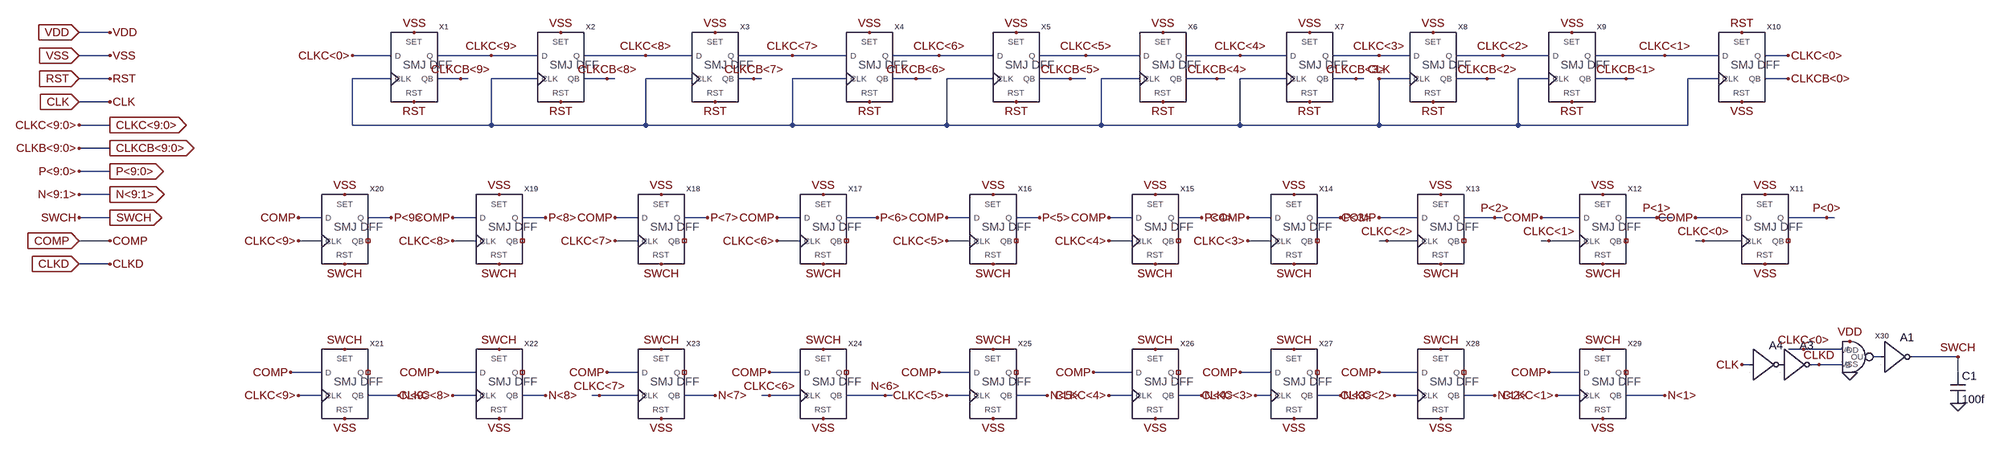
[diagram p0: schematic 10Bit_SAR_Logic.asc]
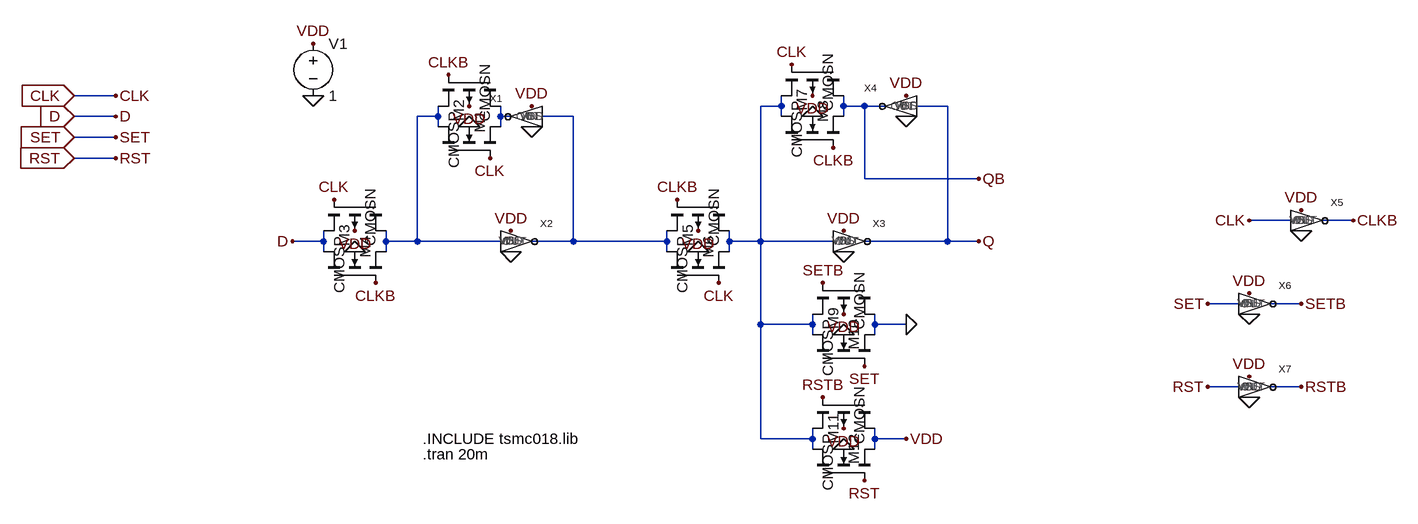
[diagram p1: sub-circuit smj_dff_x1.asc]
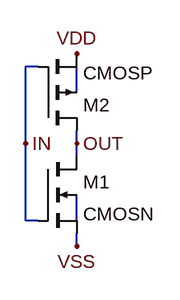
[diagram p2: sub-circuit inv_x1.asc]
10Bit_SAR_Logic.asc, the LTspice schematic file:
Version 4
SHEET 1 3224 984
WIRE -1040 -384 -1104 -384
WIRE -1040 -336 -1104 -336
WIRE -384 -336 -464 -336
WIRE -176 -336 -288 -336
WIRE -80 -336 -176 -336
WIRE 144 -336 16 -336
WIRE 240 -336 144 -336
WIRE 448 -336 336 -336
WIRE 560 -336 448 -336
WIRE 752 -336 656 -336
WIRE 864 -336 752 -336
WIRE 1056 -336 960 -336
WIRE 1168 -336 1056 -336
WIRE 1376 -336 1264 -336
WIRE 1472 -336 1376 -336
WIRE 1664 -336 1568 -336
WIRE 1728 -336 1664 -336
WIRE 1920 -336 1824 -336
WIRE 2016 -336 1920 -336
WIRE 2256 -336 2112 -336
WIRE 2368 -336 2256 -336
WIRE 2512 -336 2464 -336
WIRE -1040 -288 -1104 -288
WIRE -384 -288 -464 -288
WIRE -240 -288 -288 -288
WIRE -224 -288 -240 -288
WIRE -80 -288 -176 -288
WIRE 64 -288 16 -288
WIRE 80 -288 64 -288
WIRE 240 -288 144 -288
WIRE 368 -288 336 -288
WIRE 384 -288 368 -288
WIRE 560 -288 448 -288
WIRE 704 -288 656 -288
WIRE 736 -288 704 -288
WIRE 864 -288 768 -288
WIRE 1024 -288 960 -288
WIRE 1056 -288 1024 -288
WIRE 1168 -288 1088 -288
WIRE 1328 -288 1264 -288
WIRE 1344 -288 1328 -288
WIRE 1472 -288 1376 -288
WIRE 1616 -288 1568 -288
WIRE 1632 -288 1616 -288
WIRE 1728 -288 1664 -288
WIRE 1888 -288 1824 -288
WIRE 1904 -288 1888 -288
WIRE 2016 -288 1952 -288
WIRE 2176 -288 2112 -288
WIRE 2192 -288 2176 -288
WIRE 2368 -288 2304 -288
WIRE 2512 -288 2464 -288
WIRE -1040 -240 -1104 -240
WIRE -1040 -192 -1104 -192
WIRE -464 -192 -464 -288
WIRE -176 -192 -176 -288
WIRE -176 -192 -464 -192
WIRE 144 -192 144 -288
WIRE 144 -192 -176 -192
WIRE 448 -192 448 -288
WIRE 448 -192 144 -192
WIRE 768 -192 768 -288
WIRE 768 -192 448 -192
WIRE 1088 -192 1088 -288
WIRE 1088 -192 768 -192
WIRE 1376 -192 1376 -288
WIRE 1376 -192 1088 -192
WIRE 1664 -192 1664 -288
WIRE 1664 -192 1376 -192
WIRE 1952 -192 1952 -288
WIRE 1952 -192 1664 -192
WIRE 2304 -192 2304 -288
WIRE 2304 -192 1952 -192
WIRE -1040 -144 -1104 -144
WIRE -1040 -96 -1104 -96
WIRE -1040 -48 -1104 -48
WIRE -1040 0 -1104 0
WIRE -528 0 -576 0
WIRE -384 0 -432 0
WIRE -208 0 -256 0
WIRE -64 0 -112 0
WIRE 128 0 80 0
WIRE 272 0 224 0
WIRE 464 0 416 0
WIRE 624 0 560 0
WIRE 816 0 768 0
WIRE 960 0 912 0
WIRE 1152 0 1104 0
WIRE 1296 0 1248 0
WIRE 1440 0 1392 0
WIRE 1584 0 1536 0
WIRE 1744 0 1664 0
WIRE 1904 0 1840 0
WIRE 1920 0 1904 0
WIRE 2080 0 2000 0
WIRE 2240 0 2176 0
WIRE 2272 0 2240 0
WIRE 2416 0 2320 0
WIRE 2592 0 2512 0
WIRE 2608 0 2592 0
WIRE -1040 48 -1104 48
WIRE -528 48 -576 48
WIRE -208 48 -256 48
WIRE 128 48 80 48
WIRE 464 48 416 48
WIRE 816 48 768 48
WIRE 1152 48 1104 48
WIRE 1440 48 1392 48
WIRE 1680 48 1664 48
WIRE 1744 48 1680 48
WIRE 2016 48 2000 48
WIRE 2080 48 2016 48
WIRE 2336 48 2320 48
WIRE 2416 48 2336 48
WIRE -1040 96 -1104 96
WIRE 2544 336 2512 336
WIRE 2624 336 2544 336
WIRE 2704 352 2688 352
WIRE 2864 352 2768 352
WIRE 2432 368 2416 368
WIRE 2576 368 2560 368
WIRE 2624 368 2576 368
WIRE -528 384 -592 384
WIRE -208 384 -288 384
WIRE 128 384 64 384
WIRE 464 384 400 384
WIRE 816 384 752 384
WIRE 1152 384 1072 384
WIRE 1440 384 1376 384
WIRE 1744 384 1664 384
WIRE 2080 384 2016 384
WIRE 2864 384 2864 352
WIRE -528 432 -576 432
WIRE -368 432 -432 432
WIRE -208 432 -256 432
WIRE -64 432 -112 432
WIRE 48 432 32 432
WIRE 128 432 48 432
WIRE 288 432 224 432
WIRE 400 432 384 432
WIRE 464 432 400 432
WIRE 640 432 560 432
WIRE 656 432 640 432
WIRE 816 432 768 432
WIRE 976 432 912 432
WIRE 1152 432 1104 432
WIRE 1296 432 1248 432
WIRE 1440 432 1408 432
WIRE 1584 432 1536 432
WIRE 1744 432 1696 432
WIRE 1904 432 1840 432
WIRE 2080 432 2032 432
WIRE 2256 432 2176 432
FLAG 1664 -336 CLKC<3>
FLAG 1920 -336 CLKC<2>
FLAG 2256 -336 CLKC<1>
FLAG 1664 -288 CLK
FLAG 1792 -48 VSS
FLAG 2464 -48 VSS
FLAG 2128 -48 VSS
FLAG 2464 96 VSS
FLAG 176 336 SWCH
FLAG 512 336 SWCH
FLAG 1904 0 P<2>
FLAG 2240 0 P<1>
FLAG 2592 0 P<0>
FLAG 1680 48 CLKC<2>
FLAG 2016 48 CLKC<1>
FLAG 2336 48 CLKC<0>
FLAG 48 432 CLKC<7>
FLAG 400 432 CLKC<6>
FLAG 288 432 N<7>
FLAG 640 432 N<6>
FLAG 2544 336 CLKC<0>
FLAG 2416 -240 VSS
FLAG 1776 -240 RST
FLAG 2064 -240 RST
FLAG 1776 -384 VSS
FLAG 2064 -384 VSS
FLAG 2416 -384 RST
FLAG 2000 0 COMP
FLAG 2320 0 COMP
FLAG 400 384 COMP
FLAG 64 384 COMP
FLAG 1664 0 COMP
FLAG 2512 -336 CLKC<0>
FLAG 2864 448 0
FLAG 1792 96 SWCH
FLAG 2128 96 SWCH
FLAG 176 480 VSS
FLAG 512 480 VSS
FLAG 2864 352 SWCH
FLAG 1520 -384 VSS
FLAG 1520 -240 RST
FLAG 1216 -384 VSS
FLAG 1216 -240 RST
FLAG 1376 -336 CLKC<4>
FLAG 912 -384 VSS
FLAG 912 -240 RST
FLAG 608 -240 RST
FLAG 608 -384 VSS
FLAG 288 -240 RST
FLAG 288 -384 VSS
FLAG -32 -384 VSS
FLAG -32 -240 RST
FLAG 752 -336 CLKC<6>
FLAG 448 -336 CLKC<7>
FLAG 144 -336 CLKC<8>
FLAG -336 -384 VSS
FLAG -336 -240 RST
FLAG -464 -336 CLKC<0>
FLAG -176 -336 CLKC<9>
FLAG 1584 0 P<3>
FLAG 1392 0 COMP
FLAG 1392 48 CLKC<3>
FLAG 1296 0 P<4>
FLAG 1104 0 COMP
FLAG 1104 48 CLKC<4>
FLAG 768 0 COMP
FLAG 768 48 CLKC<5>
FLAG 960 0 P<5>
FLAG 272 0 P<7>
FLAG 80 0 COMP
FLAG 80 48 CLKC<7>
FLAG -64 0 P<8>
FLAG -256 0 COMP
FLAG -256 48 CLKC<8>
FLAG -576 0 COMP
FLAG -576 48 CLKC<9>
FLAG 416 0 COMP
FLAG 416 48 CLKC<6>
FLAG 624 0 P<6>
FLAG 1488 -48 VSS
FLAG 1488 96 SWCH
FLAG 1200 -48 VSS
FLAG 1200 96 SWCH
FLAG 864 -48 VSS
FLAG 864 96 SWCH
FLAG 512 -48 VSS
FLAG 512 96 SWCH
FLAG 176 -48 VSS
FLAG 176 96 SWCH
FLAG -160 -48 VSS
FLAG -160 96 SWCH
FLAG -480 -48 VSS
FLAG -480 96 SWCH
FLAG -592 384 COMP
FLAG -576 432 CLKC<9>
FLAG -288 384 COMP
FLAG -368 432 N<9>
FLAG -256 432 CLKC<8>
FLAG -64 432 N<8>
FLAG 752 384 COMP
FLAG 768 432 CLKC<5>
FLAG 976 432 N<5>
FLAG 1072 384 COMP
FLAG 1104 432 CLKC<4>
FLAG 1296 432 N<4>
FLAG 1376 384 COMP
FLAG 1408 432 CLKC<3>
FLAG 1584 432 N<3>
FLAG 1664 384 COMP
FLAG 1696 432 CLKC<2>
FLAG 1904 432 N<2>
FLAG 2016 384 COMP
FLAG 2032 432 CLKC<1>
FLAG 2256 432 N<1>
FLAG -480 336 SWCH
FLAG -160 336 SWCH
FLAG -480 480 VSS
FLAG -160 480 VSS
FLAG 1200 336 SWCH
FLAG 864 480 VSS
FLAG 864 336 SWCH
FLAG 1200 480 VSS
FLAG 1488 336 SWCH
FLAG 1488 480 VSS
FLAG 1792 336 SWCH
FLAG 1792 480 VSS
FLAG 2128 336 SWCH
FLAG 2128 480 VSS
FLAG -1104 -336 VSS
IOPIN -1104 -336 In
FLAG -1104 -288 RST
IOPIN -1104 -288 In
FLAG -1104 -240 CLK
IOPIN -1104 -240 In
FLAG -1104 -192 CLKC<9:0>
FLAG -1104 -96 P<9:0>
FLAG -1104 -48 N<9:1>
FLAG -1104 0 SWCH
FLAG -1104 48 COMP
IOPIN -1104 48 In
FLAG -1104 -384 VDD
IOPIN -1104 -384 In
FLAG -1040 -384 VDD
FLAG -1040 -336 VSS
FLAG -1040 -288 RST
FLAG -1040 -240 CLK
FLAG -1040 -192 CLKC<9:0>
IOPIN -1040 -192 Out
FLAG -1040 -96 P<9:0>
IOPIN -1040 -96 Out
FLAG -1040 -48 N<9:1>
IOPIN -1040 -48 Out
FLAG -1040 0 SWCH
IOPIN -1040 0 Out
FLAG -1040 48 COMP
FLAG 1056 -336 CLKC<5>
FLAG -384 0 P<9>
FLAG 2640 384 0
FLAG 2640 320 VDD
FLAG 2416 368 CLK
FLAG 2512 -288 CLKCB<0>
FLAG 2176 -288 CLKCB<1>
FLAG 1888 -288 CLKCB<2>
FLAG 1616 -288 CLKCB<3>
FLAG 1328 -288 CLKCB<4>
FLAG 1024 -288 CLKCB<5>
FLAG 704 -288 CLKCB<6>
FLAG 64 -288 CLKCB<8>
FLAG -240 -288 CLKCB<9>
FLAG 368 -288 CLKCB<7>
FLAG 2576 368 CLKD
FLAG -1104 96 CLKD
IOPIN -1104 96 In
FLAG -1040 96 CLKD
FLAG -1040 -144 CLKCB<9:0>
IOPIN -1040 -144 Out
FLAG -1104 -144 CLKB<9:0>
SYMBOL cap 2848 384 R0
SYMATTR InstName C1
SYMATTR Value 100f
SYMBOL NAND_x1 2640 352 R0
SYMATTR InstName X30
SYMBOL Digital\\inv 2704 288 R0
SYMATTR InstName A1
SYMBOL Digital\\inv 2496 304 R0
SYMATTR InstName A3
SYMATTR SpiceLine Trise 0.0025u Tfall 0.0025u
SYMBOL Digital\\inv 2432 304 R0
SYMATTR InstName A4
SYMATTR SpiceLine Trise 0.0025u Tfall 0.0025u
SYMBOL smj_dff_x1 -336 -320 R0
SYMATTR InstName X1
SYMBOL smj_dff_x1 -32 -320 R0
SYMATTR InstName X2
SYMBOL smj_dff_x1 288 -320 R0
SYMATTR InstName X3
SYMBOL smj_dff_x1 608 -320 R0
SYMATTR InstName X4
SYMBOL smj_dff_x1 912 -320 R0
SYMATTR InstName X5
SYMBOL smj_dff_x1 1216 -320 R0
SYMATTR InstName X6
SYMBOL smj_dff_x1 1520 -320 R0
SYMATTR InstName X7
SYMBOL smj_dff_x1 1776 -320 R0
SYMATTR InstName X8
SYMBOL smj_dff_x1 2064 -320 R0
SYMATTR InstName X9
SYMBOL smj_dff_x1 2416 -320 R0
SYMATTR InstName X10
SYMBOL smj_dff_x1 2464 16 R0
SYMATTR InstName X11
SYMBOL smj_dff_x1 2128 16 R0
SYMATTR InstName X12
SYMBOL smj_dff_x1 1792 16 R0
SYMATTR InstName X13
SYMBOL smj_dff_x1 1488 16 R0
SYMATTR InstName X14
SYMBOL smj_dff_x1 1200 16 R0
SYMATTR InstName X15
SYMBOL smj_dff_x1 864 16 R0
SYMATTR InstName X16
SYMBOL smj_dff_x1 512 16 R0
SYMATTR InstName X17
SYMBOL smj_dff_x1 176 16 R0
SYMATTR InstName X18
SYMBOL smj_dff_x1 -160 16 R0
SYMATTR InstName X19
SYMBOL smj_dff_x1 -480 16 R0
SYMATTR InstName X20
SYMBOL smj_dff_x1 -480 400 R0
SYMATTR InstName X21
SYMBOL smj_dff_x1 -160 400 R0
SYMATTR InstName X22
SYMBOL smj_dff_x1 176 400 R0
SYMATTR InstName X23
SYMBOL smj_dff_x1 512 400 R0
SYMATTR InstName X24
SYMBOL smj_dff_x1 864 400 R0
SYMATTR InstName X25
SYMBOL smj_dff_x1 1200 400 R0
SYMATTR InstName X26
SYMBOL smj_dff_x1 1488 400 R0
SYMATTR InstName X27
SYMBOL smj_dff_x1 1792 400 R0
SYMATTR InstName X28
SYMBOL smj_dff_x1 2128 400 R0
SYMATTR InstName X29

smj_dff_x1.asc, the sub-circuit schematic file:
Version 4
SHEET 1 1408 932
WIRE -528 96 -592 96
WIRE 496 112 496 96
WIRE 496 112 464 112
WIRE 592 112 592 96
WIRE 624 112 592 112
WIRE 656 112 624 112
WIRE 752 112 704 112
WIRE -528 128 -592 128
WIRE -32 128 -32 112
WIRE -32 128 -64 128
WIRE 64 128 64 112
WIRE 80 128 64 128
WIRE 176 128 128 128
WIRE 496 128 496 112
WIRE 592 128 592 112
WIRE -32 144 -32 128
WIRE 64 144 64 128
WIRE -528 160 -592 160
WIRE -528 192 -592 192
WIRE 624 224 624 112
WIRE 800 224 624 224
WIRE 1280 288 1216 288
WIRE 1376 288 1328 288
WIRE -208 320 -208 304
WIRE -208 320 -256 320
WIRE -112 320 -112 304
WIRE -64 320 -64 128
WIRE -64 320 -112 320
WIRE 64 320 -64 320
WIRE 176 320 176 128
WIRE 176 320 112 320
WIRE 320 320 320 304
WIRE 320 320 176 320
WIRE 416 320 416 304
WIRE 464 320 464 112
WIRE 464 320 416 320
WIRE 576 320 464 320
WIRE 752 320 752 112
WIRE 752 320 624 320
WIRE 800 320 752 320
WIRE -208 336 -208 320
WIRE -112 336 -112 320
WIRE 320 336 320 320
WIRE 416 336 416 320
WIRE 1200 416 1152 416
WIRE 1296 416 1248 416
WIRE 464 448 464 320
WIRE 544 448 544 432
WIRE 544 448 464 448
WIRE 640 448 640 432
WIRE 688 448 640 448
WIRE 544 464 544 448
WIRE 640 464 640 448
WIRE 1200 544 1152 544
WIRE 1296 544 1248 544
WIRE 464 624 464 448
WIRE 544 624 544 608
WIRE 544 624 464 624
WIRE 640 624 640 608
WIRE 688 624 640 624
WIRE 544 640 544 624
WIRE 640 640 640 624
FLAG -192 256 CLK
FLAG 48 192 CLK
FLAG 576 176 CLKB
FLAG 400 384 CLK
FLAG -16 64 CLKB
FLAG -128 384 CLKB
FLAG 336 256 CLKB
FLAG 512 48 CLK
FLAG -256 320 D
FLAG 800 320 Q
FLAG 800 224 QB
FLAG 1376 288 CLKB
FLAG 1216 288 CLK
FLAG 1296 272 VDD
FLAG 1296 304 0
FLAG -224 96 0
FLAG -224 16 VDD
FLAG 16 144 0
FLAG -160 336 0
FLAG 368 336 0
FLAG 544 128 0
FLAG 16 112 VDD
FLAG -160 304 VDD
FLAG 368 304 VDD
FLAG 544 96 VDD
FLAG 624 512 SET
FLAG 560 384 SETB
FLAG 592 464 0
FLAG 592 432 VDD
FLAG 624 688 RST
FLAG 560 560 RSTB
FLAG 592 640 0
FLAG 592 608 VDD
FLAG 688 448 0
FLAG 688 624 VDD
FLAG 1216 400 VDD
FLAG 1216 432 0
FLAG 1152 416 SET
FLAG 1296 416 SETB
FLAG 1216 528 VDD
FLAG 1216 560 0
FLAG 1152 544 RST
FLAG 1296 544 RSTB
FLAG 112 112 VDD
FLAG 80 304 VDD
FLAG 592 304 VDD
FLAG 688 96 VDD
FLAG 112 144 0
FLAG 80 336 0
FLAG 592 336 0
FLAG 688 128 0
FLAG -592 96 CLK
IOPIN -592 96 In
FLAG -592 128 D
IOPIN -592 128 In
FLAG -592 160 SET
IOPIN -592 160 In
FLAG -592 192 RST
IOPIN -592 192 In
FLAG -528 96 CLK
FLAG -528 128 D
FLAG -528 160 SET
FLAG -528 192 RST
SYMBOL cmosn -32 192 R270
SYMATTR InstName M2
SYMATTR Value2 l=180n w=1u
SYMBOL cmosp 64 64 R90
SYMATTR InstName M1
SYMATTR Value2 l=180n w=5u
SYMBOL cmosn -208 384 R270
SYMATTR InstName M3
SYMATTR Value2 l=180n w=1u
SYMBOL cmosp -112 256 R90
SYMATTR InstName M4
SYMATTR Value2 l=180n w=5u
SYMBOL cmosn 320 384 R270
SYMATTR InstName M5
SYMATTR Value2 l=180n w=1u
SYMBOL cmosp 416 256 R90
SYMATTR InstName M6
SYMATTR Value2 l=180n w=5u
SYMBOL cmosn 496 176 R270
SYMATTR InstName M7
SYMATTR Value2 l=180n w=1u
SYMBOL cmosp 592 48 R90
SYMATTR InstName M8
SYMATTR Value2 l=180n w=5u
SYMBOL inv_x1 1312 288 R0
SYMATTR InstName X5
SYMBOL voltage -224 0 R0
WINDOW 123 0 0 Left 0
WINDOW 39 0 0 Left 0
SYMATTR InstName V1
SYMATTR Value 1
SYMBOL cmosn 544 512 R270
SYMATTR InstName M9
SYMATTR Value2 l=180n w=1u
SYMBOL cmosp 640 384 R90
SYMATTR InstName M10
SYMATTR Value2 l=180n w=5u
SYMBOL cmosn 544 688 R270
SYMATTR InstName M11
SYMATTR Value2 l=180n w=1u
SYMBOL cmosp 640 560 R90
SYMATTR InstName M12
SYMATTR Value2 l=180n w=5u
SYMBOL inv_x1 1232 416 R0
SYMATTR InstName X6
SYMBOL inv_x1 1232 544 R0
SYMATTR InstName X7
SYMBOL inv_x1 96 128 M0
SYMATTR InstName X1
SYMBOL inv_x1 96 320 R0
SYMATTR InstName X2
SYMBOL inv_x1 608 320 R0
SYMATTR InstName X3
SYMBOL inv_x1 672 112 M0
SYMATTR InstName X4
TEXT -56 648 Left 2 !.tran 20m
TEXT -56 624 Left 2 !.INCLUDE tsmc018.lib

inv_x1.asc, the sub-circuit schematic file:
Version 4
SHEET 1 880 680
WIRE 160 48 144 48
WIRE 208 80 208 48
WIRE 144 144 144 48
WIRE 208 144 208 128
WIRE 208 160 208 144
WIRE 144 240 144 144
WIRE 160 240 144 240
WIRE 208 240 208 208
WIRE 208 272 208 256
FLAG 208 32 VDD
FLAG 208 272 VSS
FLAG 144 144 IN
FLAG 208 144 OUT
SYMBOL cmosn 160 160 R0
SYMATTR InstName M1
SYMATTR Value2 l=180nm w=1um
SYMBOL cmosp 160 128 M180
SYMATTR InstName M2
SYMATTR Value2 l=180nm w=5um

The netlist it stands for:
* 10Bit_SAR_Logic.asc
C1 SWCH 0 100f
XX30 CLKC<0> CLKD VDD 0 N001 NAND_x1  ; pins A B VDD VSS OUT
A1 N001 0 0 0 0 SWCH 0 0 BUF
A3 P001 0 0 0 0 CLKD 0 0 BUF Trise 0.0025u Tfall 0.0025u
A4 CLK 0 0 0 0 P001 0 0 BUF Trise 0.0025u Tfall 0.0025u
XX1 CLKC<0> CLKC<9> CLK VSS RST CLKCB<9> smj_dff_x1
XX2 CLKC<9> CLKC<8> CLK VSS RST CLKCB<8> smj_dff_x1
XX3 CLKC<8> CLKC<7> CLK VSS RST CLKCB<7> smj_dff_x1
XX4 CLKC<7> CLKC<6> CLK VSS RST CLKCB<6> smj_dff_x1
XX5 CLKC<6> CLKC<5> CLK VSS RST CLKCB<5> smj_dff_x1
XX6 CLKC<5> CLKC<4> CLK VSS RST CLKCB<4> smj_dff_x1
XX7 CLKC<4> CLKC<3> CLK VSS RST CLKCB<3> smj_dff_x1
XX8 CLKC<3> CLKC<2> CLK VSS RST CLKCB<2> smj_dff_x1
XX9 CLKC<2> CLKC<1> CLK VSS RST CLKCB<1> smj_dff_x1
XX10 CLKC<1> CLKC<0> CLK RST VSS CLKCB<0> smj_dff_x1
XX11 COMP P<0> CLKC<0> VSS VSS NC_01 smj_dff_x1
XX12 COMP P<1> CLKC<1> VSS SWCH NC_02 smj_dff_x1
XX13 COMP P<2> CLKC<2> VSS SWCH NC_03 smj_dff_x1
XX14 COMP P<3> CLKC<3> VSS SWCH NC_04 smj_dff_x1
XX15 COMP P<4> CLKC<4> VSS SWCH NC_05 smj_dff_x1
XX16 COMP P<5> CLKC<5> VSS SWCH NC_06 smj_dff_x1
XX17 COMP P<6> CLKC<6> VSS SWCH NC_07 smj_dff_x1
XX18 COMP P<7> CLKC<7> VSS SWCH NC_08 smj_dff_x1
XX19 COMP P<8> CLKC<8> VSS SWCH NC_09 smj_dff_x1
XX20 COMP P<9> CLKC<9> VSS SWCH NC_10 smj_dff_x1
XX21 COMP NC_11 CLKC<9> SWCH VSS N<9> smj_dff_x1
XX22 COMP NC_12 CLKC<8> SWCH VSS N<8> smj_dff_x1
XX23 COMP NC_13 CLKC<7> SWCH VSS N<7> smj_dff_x1
XX24 COMP NC_14 CLKC<6> SWCH VSS N<6> smj_dff_x1
XX25 COMP NC_15 CLKC<5> SWCH VSS N<5> smj_dff_x1
XX26 COMP NC_16 CLKC<4> SWCH VSS N<4> smj_dff_x1
XX27 COMP NC_17 CLKC<3> SWCH VSS N<3> smj_dff_x1
XX28 COMP NC_18 CLKC<2> SWCH VSS N<2> smj_dff_x1
XX29 COMP NC_19 CLKC<1> SWCH VSS N<1> smj_dff_x1

* block symbol definitions
.subckt smj_dff_x1 D Q CLK SET RST QB
M2 N002 CLK N003 0 CMOSN l=180n w=1u
M1 N003 CLKB N002 VDD CMOSP l=180n w=5u
M3 D CLKB N002 0 CMOSN l=180n w=1u
M4 N002 CLK D VDD CMOSP l=180n w=5u
M5 N004 CLK N001 0 CMOSN l=180n w=1u
M6 N001 CLKB N004 VDD CMOSP l=180n w=5u
M7 N001 CLKB QB 0 CMOSN l=180n w=1u
M8 QB CLK N001 VDD CMOSP l=180n w=5u
XX5 CLK CLKB VDD 0 inv_x1
V1 VDD 0 1
M9 N001 SET 0 0 CMOSN l=180n w=1u
M10 0 SETB N001 VDD CMOSP l=180n w=5u
M11 N001 RST VDD 0 CMOSN l=180n w=1u
M12 VDD RSTB N001 VDD CMOSP l=180n w=5u
XX6 SET SETB VDD 0 inv_x1
XX7 RST RSTB VDD 0 inv_x1
XX1 N004 N003 VDD 0 inv_x1
XX2 N002 N004 VDD 0 inv_x1
XX3 N001 Q VDD 0 inv_x1
XX4 Q QB VDD 0 inv_x1
.tran 20m
.INCLUDE tsmc018.lib
.ends smj_dff_x1

.subckt inv_x1 IN OUT VDD VSS
M1 OUT IN VSS N002 CMOSN l=180nm w=1um
M2 OUT IN VDD N001 CMOSP l=180nm w=5um
.ends inv_x1

.model NMOS NMOS
.model PMOS PMOS
.lib standard.mos
.backanno
.end